# Altium schematic sheet [03] - POWER SUPPLIES.SchDoc
size A4; DocumentNumber: 3; SheetNumber: 3; SheetTotal: 9
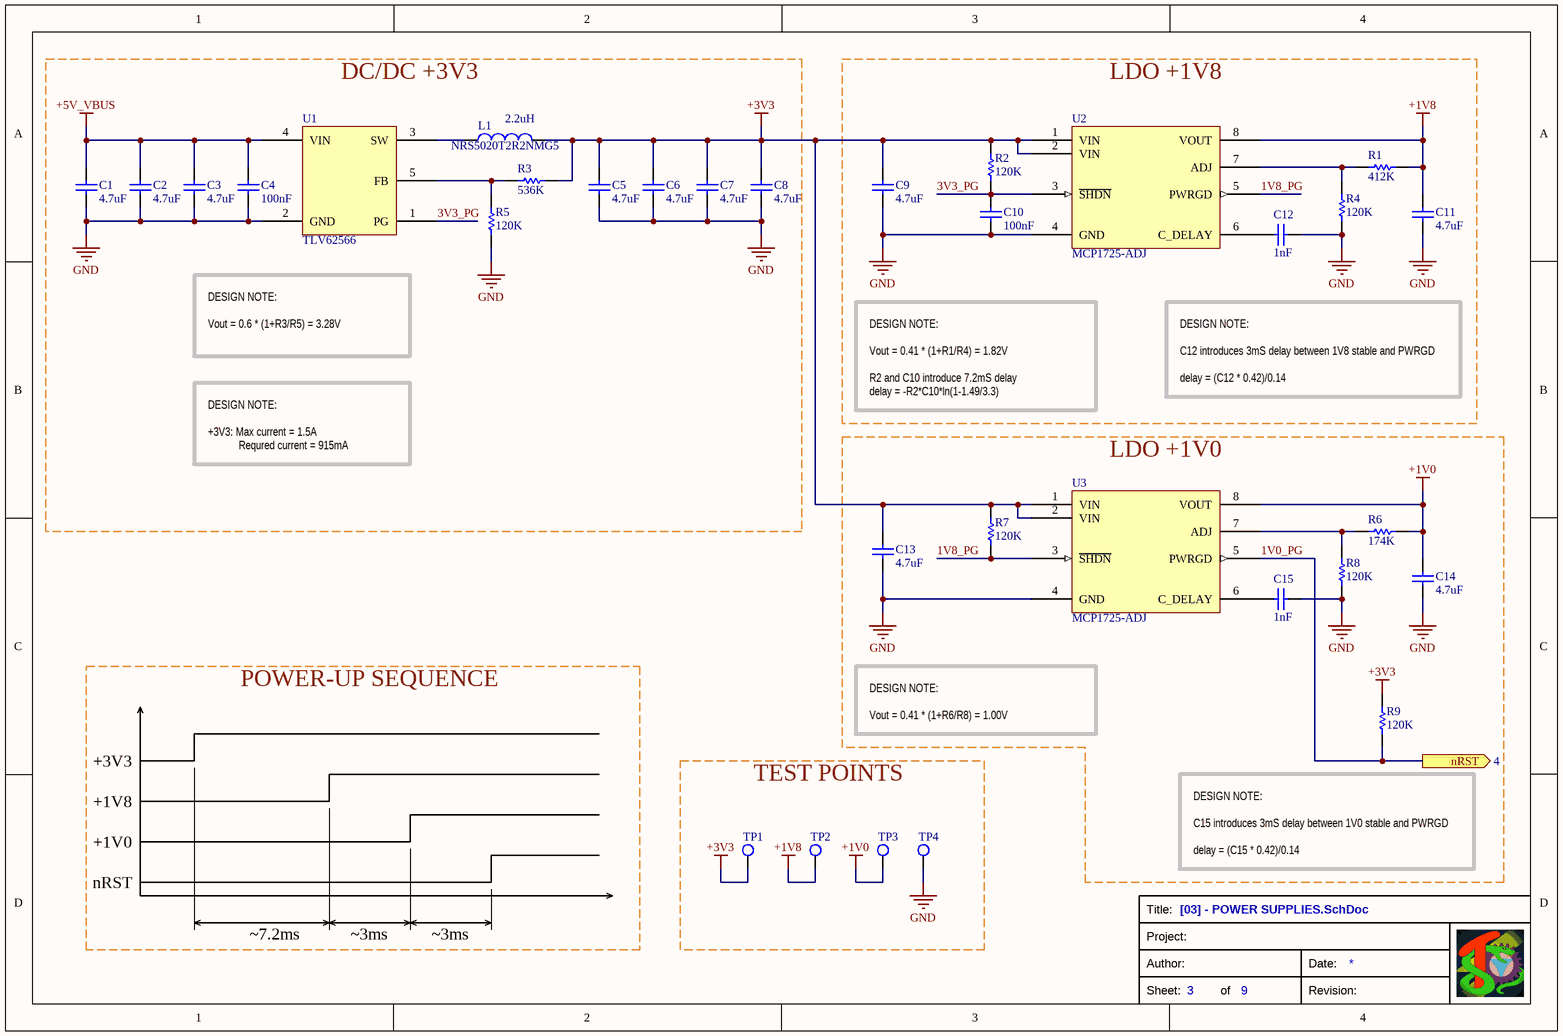
[diagram p0: [03] - POWER SUPPLIES.SchDoc]

## Parts
C1  value 4.7uF  [CAP-0805]  (hidden comment: 885012107013)
C2  value 4.7uF  [CAP-0805]  (hidden comment: 885012107013)
C3  value 4.7uF  [CAP-0805]  (hidden comment: 885012107013)
C4  value 100nF  [CAP-0603]  (hidden comment: C0603C104M4RAC)
C5  value 4.7uF  [CAP-0805]  (hidden comment: 885012107013)
C6  value 4.7uF  [CAP-0805]  (hidden comment: 885012107013)
C7  value 4.7uF  [CAP-0805]  (hidden comment: 885012107013)
C8  value 4.7uF  [CAP-0805]  (hidden comment: 885012107013)
C9  value 4.7uF  [CAP-0805]  (hidden comment: 885012107013)
C10  value 100nF  [CAP-0603]  (hidden comment: C0603C104M4RAC)
C11  value 4.7uF  [CAP-0805]  (hidden comment: 885012107013)
C12  value 1nF  [CAP-0603]  (hidden comment: C0603C102J5RACTU)
C13  value 4.7uF  [CAP-0805]  (hidden comment: 885012107013)
C14  value 4.7uF  [CAP-0805]  (hidden comment: 885012107013)
C15  value 1nF  [CAP-0603]  (hidden comment: C0603C102J5RACTU)
L1  NRS5020T2R2NMG5  value 2.2uH  [NRS5020-SMT-INDUCTOR]
R1  value 412K  [RES-0603]  (hidden comment: RT0603FRE07412KL)
R2  value 120K  [RES-0603]  (hidden comment: RT0603FRE07120KL)
R3  value 536K  [RES-0603]  (hidden comment: RT0603FRE07536KL)
R4  value 120K  [RES-0603]  (hidden comment: RT0603FRE07120KL)
R5  value 120K  [RES-0603]  (hidden comment: RT0603FRE07120KL)
R6  value 174K  [RES-0603]  (hidden comment: RT0603FRE07174KL)
R7  value 120K  [RES-0603]  (hidden comment: RT0603FRE07120KL)
R8  value 120K  [RES-0603]  (hidden comment: RT0603FRE07120KL)
R9  value 120K  [RES-0603]  (hidden comment: RT0603FRE07120KL)
TP1  Test Point 1mm  [TESTPOINT-1mm]  (value not drawn)  (no BOM)
TP2  Test Point 1mm  [TESTPOINT-1mm]  (value not drawn)  (no BOM)
TP3  Test Point 1mm  [TESTPOINT-1mm]  (value not drawn)  (no BOM)
TP4  Test Point 1mm  [TESTPOINT-1mm]  (value not drawn)  (no BOM)
U1  TLV62566  [SOT23-5]
U2  MCP1725-ADJ  [SOIC-8_3.9X4.9]
U3  MCP1725-ADJ  [SOIC-8_3.9X4.9]

## Blocks framed on the sheet
DC/DC +3V3: C1-C8 L1 R3 R5 U1
LDO +1V8: C9-C12 R1 R2 R4 U2
LDO +1V0: C13-C15 R6-R9 U3
TEST POINTS: TP1-TP4

## Ports
nRST (out, see 4)

## Nets
+1V0: C14.2 R6.2 TP3.1 U3.8(VOUT)
+1V8: C11.2 R1.2 TP2.1 U2.8(VOUT)
+3V3: C5.2 C6.2 C7.2 C8.2 C9.2 C13.2 L1.2 R2.2 R3.1 R7.2 R9.2 TP1.1 U2.1(VIN) U2.2(VIN) U3.1(VIN) U3.2(VIN)
+5V_VBUS: C1.2 C2.2 C3.2 C4.2 U1.4(VIN)
GND: C1.1 C2.1 C3.1 C4.1 C5.1 C6.1 C7.1 C8.1 C9.1 C10.1 C11.1 C12.1 C13.1 C14.1 C15.1 R4.1 R5.1 R8.1 TP4.1 U1.2(GND) U2.4(GND) U3.4(GND)
1V0_PG: R9.1 U3.5(PWRGD) ; port nRST
1V8_PG: R7.1 U2.5(PWRGD) U3.3(~{SHDN})
3V3_PG: C10.2 R2.1 U1.1(PG) U2.3(~{SHDN})
NetC12_2: C12.2 U2.6(C_DELAY)
NetC15_2: C15.2 U3.6(C_DELAY)
NetL1_1: L1.1 U1.3(SW)
NetR1_1: R1.1 R4.2 U2.7(ADJ)
NetR3_2: R3.2 R5.2 U1.5(FB)
NetR6_1: R6.1 R8.2 U3.7(ADJ)

## Notes on the sheet
- DESIGN NOTE:
  Vout = 0.6 * (1+R3/R5) = 3.28V
- DESIGN NOTE:
  C12 introduces 3mS delay between 1V8 stable and PWRGD
  delay = (C12 * 0.42)/0.14
- DESIGN NOTE:
  +3V3: Max current = 1.5A
  Requred current = 915mA
- DESIGN NOTE:
  Vout = 0.41 * (1+R1/R4) = 1.82V
  R2 and C10 introduce 7.2mS delay
  delay = -R2*C10*ln(1-1.49/3.3)
- POWER-UP SEQUENCE
- +3V3
- DESIGN NOTE:
  Vout = 0.41 * (1+R6/R8) = 1.00V
- +1V8
- +1V0
- nRST
- ~7.2ms
- ~3ms
- DESIGN NOTE:
  C15 introduces 3mS delay between 1V0 stable and PWRGD
  delay = (C15 * 0.42)/0.14
- Title:
- Project:
- Sheet:
- Author:
- of
- Revision:
- Date:

## Library data of the parts
C1-C3 C5-C9 C11 C13 C14 = CAP-0805-4.7u-885012107013_2: Multilayer Ceramic Capacitors MLCC - SMD/SMT WCAP-CSGP 4.7uF 0805 20% 16V MLCC; Manufacturer: Wurth Elektronik; Voltage Rating DC: 16 VDC; Supplier 1: Mouser; Supplier Part Number 1: 710-885012107013
C4 C10 = CAP-0603-100n-C0603C104M4RAC: Multilayer Ceramic Capacitors MLCC - SMD/SMT 16V 0.1uF X7R 0603 20%; Manufacturer: KEMET; Voltage Rating DC: 16 VDC; Supplier 1: Mouser; Supplier Part Number 1: 80-C0603C104M4RAC
C12 C15 = CAP-0603-1n-C0603C102J5RACTU: Multilayer Ceramic Capacitors MLCC - SMD/SMT 50V 1000pF X7R 0603 5%; Manufacturer: KEMET; Voltage Rating DC: 50 VDC; Supplier 1: Mouser; Supplier Part Number 1: 80-C0603C102J5R
L1 = IND-NRS5020T2R2NMG5: Fixed Inductors 5020 2.2uH 42mOhms +/-30%Tol 2900mA; Supplier 1: Mouser; Supplier Part Number 1: 963-NRS5020T2R2NMGJ
R1 = RES-0603-412K-RT0603FRE07412KL: Thin Film Resistors - SMD 1/10W 412K ohm 1% 50ppm; Manufacturer: Yageo; Supplier 1: Mouser; Supplier Part Number 1: 603-RT0603FRE07412KL
R2 R4 R5 R7-R9 = RES-0603-120K-RT0603FRE07120KL: Thin Film Resistors - SMD 1/10W 120K ohm 1% 50ppm; Manufacturer: Yageo; Supplier 1: Mouser; Supplier Part Number 1: 603-RT0603FRE07120KL
R3 = RES-0603-536K-RT0603FRE07536KL: Thin Film Resistors - SMD 1/10W 536K ohm 1% 50ppm; Manufacturer: Yageo; Supplier 1: Mouser; Supplier Part Number 1: 603-RT0603FRE07536KL
R6 = RES-0603-174K-RT0603FRE07174KL: Thin Film Resistors - SMD 1/10W 174K ohm 1% 50ppm; Manufacturer: Yageo; Supplier 1: Mouser; Supplier Part Number 1: 603-RT0603FRE07174KL
TP1-TP4 = TESTPOINT-1mm: Value: Value
U1 = TLV62566: TLV6256x 1.5-A High Efficiency Step-Down Converters in SOT-23 5-Pin Package; Supplier 1: Mouser; Supplier Part Number 1: 595-TLV62566DBVR
U2 U3 = MCP1725-ADJ: 500 mA, Low Voltage, Low Quiescent Current LDO Regulator; Supplier 1: Mouser; Supplier Part Number 1: 579-MCP1725-ADJE/SN